# EAGLE schematic Power_supply (EAGLE 9.5.1)
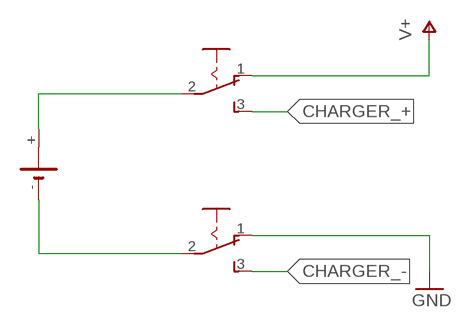
[diagram p0: schematic, sheet 1]

## Parts
G1  CR1/2  [CR1/2]
S1  255SB  [255SB]
S2  255SB  [255SB]

## Nets
CHARGER_+: S1.3(S)
CHARGER_-: S2.3(S)
GND: S2.1(O)
N$1: G1.+ S1.2(P)
N$2: G1.- S2.2(P)
V+: S1.1(O)
Unconnected: G1.+@1(+)

## Library data of the parts
G1 = battery:CR1/2: LI BATTERY Sonnenschein SL-350 PT
S1 S2 = switch:255SB: SLIDING SWITCH Distributor Buerklin, 11G810